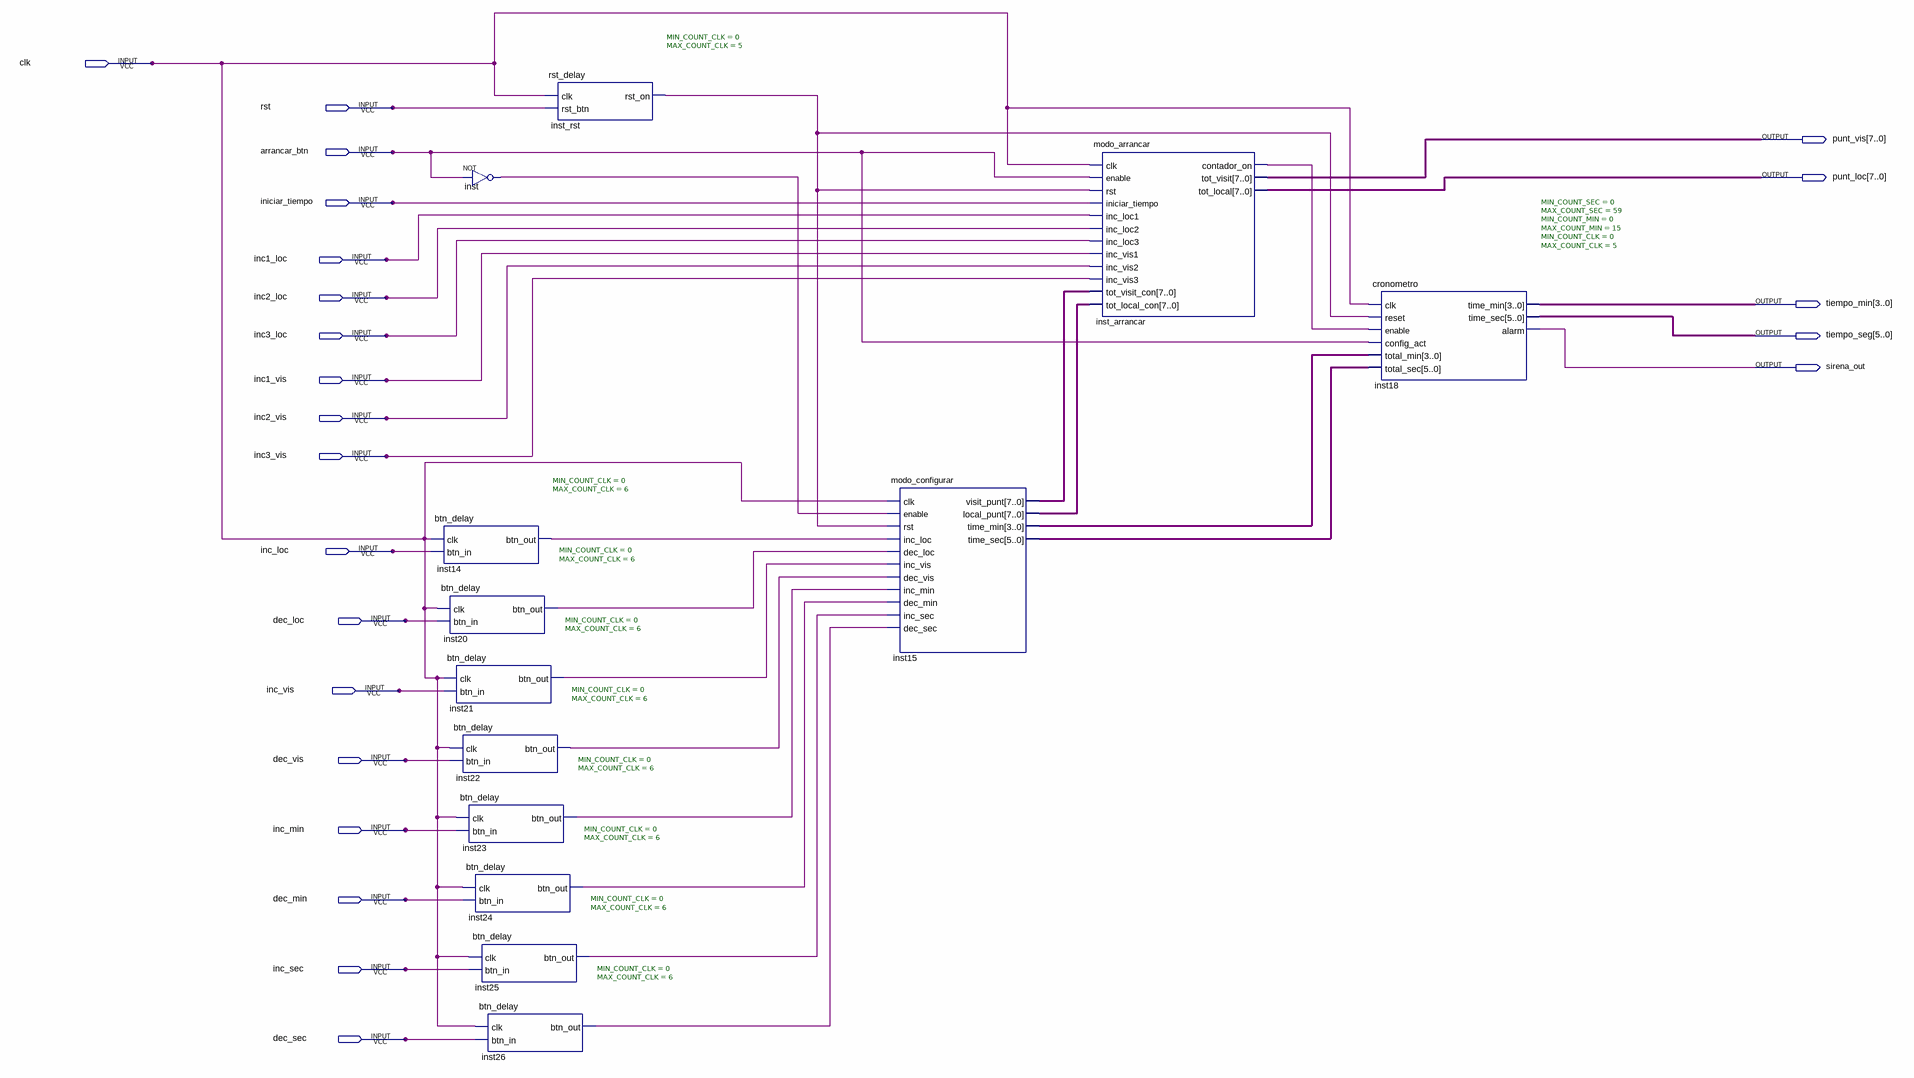
[diagram p0: schematic sheet]
// Quartus schematic MarcadorBaloncesto_mainv2.bdf as structural Verilog: 13 symbols, 23 pins
module MarcadorBaloncesto_mainv2 (
  input  clk,
  input  rst,
  input  arrancar_btn,
  input  iniciar_tiempo,
  input  inc1_loc,
  input  inc2_loc,
  input  inc3_loc,
  input  inc1_vis,
  input  inc2_vis,
  input  inc3_vis,
  input  inc_loc,
  input  dec_loc,
  input  inc_vis,
  input  dec_vis,
  input  inc_min,
  input  dec_min,
  input  inc_sec,
  input  dec_sec,
  output [7:0] punt_vis,
  output [7:0] punt_loc,
  output [3:0] tiempo_min,
  output [5:0] tiempo_seg,
  output sirena_out
);

  wire inst14_btn_out, inst20_btn_out, inst21_btn_out, inst22_btn_out, inst23_btn_out, inst24_btn_out,
       inst25_btn_out, inst26_btn_out, inst_arrancar_contador_on, inst_out, inst_rst_rst_on;
  wire [3:0] inst15_time_min;
  wire [5:0] inst15_time_sec;
  wire [7:0] inst15_local_punt, inst15_visit_punt;

  not inst (inst_out, arrancar_btn);
  btn_delay #(.MIN_COUNT_CLK(0), .MAX_COUNT_CLK(6)) inst14 (.clk(clk), .btn_in(inc_loc), .btn_out(inst14_btn_out));
  btn_delay #(.MIN_COUNT_CLK(0), .MAX_COUNT_CLK(6)) inst20 (.clk(clk), .btn_in(dec_loc), .btn_out(inst20_btn_out));
  btn_delay #(.MIN_COUNT_CLK(0), .MAX_COUNT_CLK(6)) inst21 (.clk(clk), .btn_in(inc_vis), .btn_out(inst21_btn_out));
  btn_delay #(.MIN_COUNT_CLK(0), .MAX_COUNT_CLK(6)) inst22 (.clk(clk), .btn_in(dec_vis), .btn_out(inst22_btn_out));
  btn_delay #(.MIN_COUNT_CLK(0), .MAX_COUNT_CLK(6)) inst23 (.clk(clk), .btn_in(inc_min), .btn_out(inst23_btn_out));
  btn_delay #(.MIN_COUNT_CLK(0), .MAX_COUNT_CLK(6)) inst24 (.clk(clk), .btn_in(dec_min), .btn_out(inst24_btn_out));
  btn_delay #(.MIN_COUNT_CLK(0), .MAX_COUNT_CLK(6)) inst25 (.clk(clk), .btn_in(inc_sec), .btn_out(inst25_btn_out));
  btn_delay #(.MIN_COUNT_CLK(0), .MAX_COUNT_CLK(6)) inst26 (.clk(clk), .btn_in(dec_sec), .btn_out(inst26_btn_out));
  rst_delay #(.MIN_COUNT_CLK(0), .MAX_COUNT_CLK(5)) inst_rst (.clk(clk), .rst_btn(rst), .rst_on(inst_rst_rst_on));
  modo_configurar inst15 (
    .clk(clk), .enable(inst_out), .rst(inst_rst_rst_on), .inc_loc(inst14_btn_out), .dec_loc(inst20_btn_out),
    .inc_vis(inst21_btn_out), .dec_vis(inst22_btn_out), .inc_min(inst23_btn_out), .dec_min(inst24_btn_out),
    .inc_sec(inst25_btn_out), .dec_sec(inst26_btn_out), .visit_punt(inst15_visit_punt),
    .local_punt(inst15_local_punt), .time_min(inst15_time_min), .time_sec(inst15_time_sec));
  modo_arrancar inst_arrancar (
    .clk(clk), .enable(arrancar_btn), .rst(inst_rst_rst_on), .iniciar_tiempo(iniciar_tiempo),
    .inc_loc1(inc1_loc), .inc_loc2(inc2_loc), .inc_loc3(inc3_loc), .inc_vis1(inc1_vis), .inc_vis2(inc2_vis),
    .inc_vis3(inc3_vis), .tot_visit_con(inst15_visit_punt), .tot_local_con(inst15_local_punt),
    .contador_on(inst_arrancar_contador_on), .tot_visit(punt_vis), .tot_local(punt_loc));
  cronometro #(.MIN_COUNT_SEC(0), .MAX_COUNT_SEC(59), .MIN_COUNT_MIN(0), .MAX_COUNT_MIN(15), .MIN_COUNT_CLK(0), .MAX_COUNT_CLK(5)) inst18 (
    .clk(clk), .reset(inst_rst_rst_on), .enable(inst_arrancar_contador_on), .config_act(arrancar_btn),
    .total_min(inst15_time_min), .total_sec(inst15_time_sec), .time_min(tiempo_min), .time_sec(tiempo_seg),
    .alarm(sirena_out));
endmodule
